# Altium project pay-optical.PrjPCB (part 2 of 2)
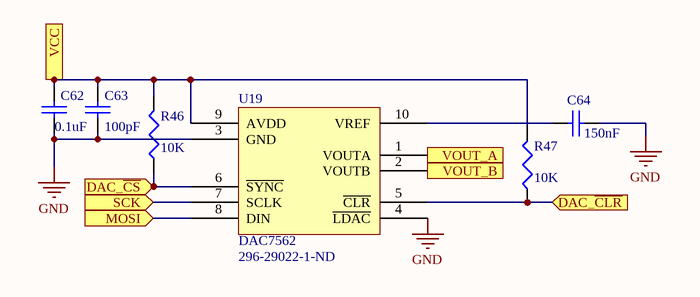
[diagram p8: dac-layout.SchDoc]

## Nets that join several sheets
3V: pay-optical (C13.2 U10.1), adc-optical (12 pins), U_adc-optical/SD1 (14 pins), U_adc-optical/SD1/AC1 (6 pins), U_adc-optical/SD1/AC2 (6 pins), U_adc-optical/SD1/AC3 (6 pins), U_adc-optical/SD1/AC4 (6 pins), U_adc-optical/SD1/AC5 (6 pins), U_adc-optical/SD1/AC6 (6 pins), U_adc-optical/SD1/AC7 (6 pins), U_adc-optical/SD1/AC8 (6 pins), U_adc-optical/SD1/MUX_LED (C44_MUX_LED1.2 C45_MUX_LED1.2 R27_MUX_LED1.2 U12_MUX_LED1.16), U_adc-optical/SD1/MUX_S (C44_MUX_S1.2 C45_MUX_S1.2 R27_MUX_S1.2 U12_MUX_S1.16), U_adc-optical/SD2 (14 pins), U_adc-optical/SD2/AC1 (6 pins), U_adc-optical/SD2/AC2 (6 pins), U_adc-optical/SD2/AC3 (6 pins), U_adc-optical/SD2/AC4 (6 pins), U_adc-optical/SD2/AC5 (6 pins), U_adc-optical/SD2/AC6 (6 pins), U_adc-optical/SD2/AC7 (6 pins), U_adc-optical/SD2/AC8 (6 pins), U_adc-optical/SD2/MUX_LED (C44_MUX_LED2.2 C45_MUX_LED2.2 R27_MUX_LED2.2 U12_MUX_LED2.16), U_adc-optical/SD2/MUX_S (C44_MUX_S2.2 C45_MUX_S2.2 R27_MUX_S2.2 U12_MUX_S2.16), U_adc-optical/SD3 (14 pins), U_adc-optical/SD3/AC1 (6 pins), U_adc-optical/SD3/AC2 (6 pins), U_adc-optical/SD3/AC3 (6 pins), U_adc-optical/SD3/AC4 (6 pins), U_adc-optical/SD3/AC5 (6 pins), U_adc-optical/SD3/AC6 (6 pins), U_adc-optical/SD3/AC7 (6 pins), U_adc-optical/SD3/AC8 (6 pins), U_adc-optical/SD3/MUX_LED (C44_MUX_LED3.2 C45_MUX_LED3.2 R27_MUX_LED3.2 U12_MUX_LED3.16), U_adc-optical/SD3/MUX_S (C44_MUX_S3.2 C45_MUX_S3.2 R27_MUX_S3.2 U12_MUX_S3.16), U_adc-optical/SD4 (14 pins), U_adc-optical/SD4/AC1 (6 pins), U_adc-optical/SD4/AC2 (6 pins), U_adc-optical/SD4/AC3 (6 pins), U_adc-optical/SD4/AC4 (6 pins), U_adc-optical/SD4/AC5 (6 pins), U_adc-optical/SD4/AC6 (6 pins), U_adc-optical/SD4/AC7 (6 pins), U_adc-optical/SD4/AC8 (6 pins), U_adc-optical/SD4/MUX_LED (C44_MUX_LED4.2 C45_MUX_LED4.2 R27_MUX_LED4.2 U12_MUX_LED4.16), U_adc-optical/SD4/MUX_S (C44_MUX_S4.2 C45_MUX_S4.2 R27_MUX_S4.2 U12_MUX_S4.16), U_adc-optical/SD5_Special/AC1 (6 pins), U_adc-optical/SD5_Special/AC2 (6 pins), U_adc-optical/SD5_Special/MUX_LED (C44_MUX_LED5.2 C45_MUX_LED5.2 R27_MUX_LED5.2 U12_MUX_LED5.16), U_adc-optical/SD5_Special/MUX_S (C44_MUX_S5.2 C45_MUX_S5.2 R27_MUX_S5.2 U12_MUX_S5.16), amplifier-special (6 pins), dac-layout (5 pins)
3V3: pay-optical (5 pins), adc-optical (C11.2 R3.2 R4.2 U1.24)
GND: pay-optical (8 pins), adc-optical (26 pins), U_adc-optical/SD1 (17 pins), U_adc-optical/SD1/AC1 (8 pins), U_adc-optical/SD1/AC2 (8 pins), U_adc-optical/SD1/AC3 (8 pins), U_adc-optical/SD1/AC4 (8 pins), U_adc-optical/SD1/AC5 (8 pins), U_adc-optical/SD1/AC6 (8 pins), U_adc-optical/SD1/AC7 (8 pins), U_adc-optical/SD1/AC8 (8 pins), U_adc-optical/SD1/MUX_LED (C44_MUX_LED1.1 C45_MUX_LED1.1 U12_MUX_LED1.7 U12_MUX_LED1.8), U_adc-optical/SD1/MUX_S (C44_MUX_S1.1 C45_MUX_S1.1 U12_MUX_S1.7 U12_MUX_S1.8), U_adc-optical/SD2 (17 pins), U_adc-optical/SD2/AC1 (8 pins), U_adc-optical/SD2/AC2 (8 pins), U_adc-optical/SD2/AC3 (8 pins), U_adc-optical/SD2/AC4 (8 pins), U_adc-optical/SD2/AC5 (8 pins), U_adc-optical/SD2/AC6 (8 pins), U_adc-optical/SD2/AC7 (8 pins), U_adc-optical/SD2/AC8 (8 pins), U_adc-optical/SD2/MUX_LED (C44_MUX_LED2.1 C45_MUX_LED2.1 U12_MUX_LED2.7 U12_MUX_LED2.8), U_adc-optical/SD2/MUX_S (C44_MUX_S2.1 C45_MUX_S2.1 U12_MUX_S2.7 U12_MUX_S2.8), U_adc-optical/SD3 (17 pins), U_adc-optical/SD3/AC1 (8 pins), U_adc-optical/SD3/AC2 (8 pins), U_adc-optical/SD3/AC3 (8 pins), U_adc-optical/SD3/AC4 (8 pins), U_adc-optical/SD3/AC5 (8 pins), U_adc-optical/SD3/AC6 (8 pins), U_adc-optical/SD3/AC7 (8 pins), U_adc-optical/SD3/AC8 (8 pins), U_adc-optical/SD3/MUX_LED (C44_MUX_LED3.1 C45_MUX_LED3.1 U12_MUX_LED3.7 U12_MUX_LED3.8), U_adc-optical/SD3/MUX_S (C44_MUX_S3.1 C45_MUX_S3.1 U12_MUX_S3.7 U12_MUX_S3.8), U_adc-optical/SD4 (17 pins), U_adc-optical/SD4/AC1 (8 pins), U_adc-optical/SD4/AC2 (8 pins), U_adc-optical/SD4/AC3 (8 pins), U_adc-optical/SD4/AC4 (8 pins), U_adc-optical/SD4/AC5 (8 pins), U_adc-optical/SD4/AC6 (8 pins), U_adc-optical/SD4/AC7 (8 pins), U_adc-optical/SD4/AC8 (8 pins), U_adc-optical/SD4/MUX_LED (C44_MUX_LED4.1 C45_MUX_LED4.1 U12_MUX_LED4.7 U12_MUX_LED4.8), U_adc-optical/SD4/MUX_S (C44_MUX_S4.1 C45_MUX_S4.1 U12_MUX_S4.7 U12_MUX_S4.8), U_adc-optical/SD5_Special/AC1 (8 pins), U_adc-optical/SD5_Special/AC2 (8 pins), U_adc-optical/SD5_Special/MUX_LED (C44_MUX_LED5.1 C45_MUX_LED5.1 U12_MUX_LED5.7 U12_MUX_LED5.8), U_adc-optical/SD5_Special/MUX_S (C44_MUX_S5.1 C45_MUX_S5.1 U12_MUX_S5.7 U12_MUX_S5.8), amplifier-special (17 pins), dac-layout (5 pins)
A0: adc-optical (R1.1 U1.4), U_adc-optical/SD1/MUX_LED (U12_MUX_LED1.11), U_adc-optical/SD1/MUX_S (U12_MUX_S1.11), U_adc-optical/SD2/MUX_LED (U12_MUX_LED2.11), U_adc-optical/SD2/MUX_S (U12_MUX_S2.11), U_adc-optical/SD3/MUX_LED (U12_MUX_LED3.11), U_adc-optical/SD3/MUX_S (U12_MUX_S3.11), U_adc-optical/SD4/MUX_LED (U12_MUX_LED4.11), U_adc-optical/SD4/MUX_S (U12_MUX_S4.11), U_adc-optical/SD5_Special/MUX_LED (U12_MUX_LED5.11), U_adc-optical/SD5_Special/MUX_S (U12_MUX_S5.11)
A1: adc-optical (R1.2 U1.3), U_adc-optical/SD1/MUX_LED (U12_MUX_LED1.10), U_adc-optical/SD1/MUX_S (U12_MUX_S1.10), U_adc-optical/SD2/MUX_LED (U12_MUX_LED2.10), U_adc-optical/SD2/MUX_S (U12_MUX_S2.10), U_adc-optical/SD3/MUX_LED (U12_MUX_LED3.10), U_adc-optical/SD3/MUX_S (U12_MUX_S3.10), U_adc-optical/SD4/MUX_LED (U12_MUX_LED4.10), U_adc-optical/SD4/MUX_S (U12_MUX_S4.10), U_adc-optical/SD5_Special/MUX_LED (U12_MUX_LED5.10), U_adc-optical/SD5_Special/MUX_S (U12_MUX_S5.10)
A2: adc-optical (R1.3 U1.2), U_adc-optical/SD1/MUX_LED (U12_MUX_LED1.9), U_adc-optical/SD1/MUX_S (U12_MUX_S1.9), U_adc-optical/SD2/MUX_LED (U12_MUX_LED2.9), U_adc-optical/SD2/MUX_S (U12_MUX_S2.9), U_adc-optical/SD3/MUX_LED (U12_MUX_LED3.9), U_adc-optical/SD3/MUX_S (U12_MUX_S3.9), U_adc-optical/SD4/MUX_LED (U12_MUX_LED4.9), U_adc-optical/SD4/MUX_S (U12_MUX_S4.9), U_adc-optical/SD5_Special/MUX_LED (U12_MUX_LED5.9), U_adc-optical/SD5_Special/MUX_S (U12_MUX_S5.9)
ADC_~{CS}: pay-optical (P1.14), adc-optical (R3.1 U1.32)
ADC_~{SYNC}: pay-optical (P1.16), adc-optical (R4.1 U1.25)
CLKIN: pay-optical (P1.18), U_adc-optical/SD1 (R14_SD1.2), U_adc-optical/SD2 (R14_SD2.2), U_adc-optical/SD3 (R14_SD3.2), U_adc-optical/SD4 (R14_SD4.2)
DAC_~{CS}: pay-optical (P1.12), dac-layout (R46.1 U19.6)
~{EN}: adc-optical (R1.4 U1.1 U15.4), U_adc-optical/SD1/MUX_LED (R27_MUX_LED1.1 U12_MUX_LED1.6), U_adc-optical/SD1/MUX_S (R27_MUX_S1.1 U12_MUX_S1.6), U_adc-optical/SD2/MUX_LED (R27_MUX_LED2.1 U12_MUX_LED2.6), U_adc-optical/SD2/MUX_S (R27_MUX_S2.1 U12_MUX_S2.6), U_adc-optical/SD3/MUX_LED (R27_MUX_LED3.1 U12_MUX_LED3.6), U_adc-optical/SD3/MUX_S (R27_MUX_S3.1 U12_MUX_S3.6)
MISO: pay-optical (P1.4), adc-optical (U1.27)
MOSI: pay-optical (P1.6), adc-optical (U1.28), U_adc-optical/SD1 (U6_SD1.14), U_adc-optical/SD2 (U6_SD2.14), U_adc-optical/SD3 (U6_SD3.14), U_adc-optical/SD4 (U6_SD4.14), dac-layout (U19.8)
MUX_5_EN: pay-optical (P1.10), adc-optical (R7.1 U15.3), U_adc-optical/SD5_Special/MUX_LED (R27_MUX_LED5.1 U12_MUX_LED5.6), U_adc-optical/SD5_Special/MUX_S (R27_MUX_S5.1 U12_MUX_S5.6)
MUX_~{EN}: adc-optical (R6.1 U15.1), U_adc-optical/SD4/MUX_LED (R27_MUX_LED4.1 U12_MUX_LED4.6), U_adc-optical/SD4/MUX_S (R27_MUX_S4.1 U12_MUX_S4.6)
NetC18_1: U_adc-optical/SD5_Special/MUX_S (U12_MUX_S5.12), amplifier-special (C18.1 R35.2 U5.1)
NetC27_SD1_2: U_adc-optical/SD1 (C27_SD1.2), U_adc-optical/SD1/MUX_S (U12_MUX_S1.3)
NetC27_SD2_2: U_adc-optical/SD2 (C27_SD2.2), U_adc-optical/SD2/MUX_S (U12_MUX_S2.3)
NetC27_SD3_2: U_adc-optical/SD3 (C27_SD3.2), U_adc-optical/SD3/MUX_S (U12_MUX_S3.3)
NetC27_SD4_2: U_adc-optical/SD4 (C27_SD4.2), U_adc-optical/SD4/MUX_S (U12_MUX_S4.3), U_adc-optical/SD5_Special/MUX_S (U12_MUX_S5.3)
NetR2_1: adc-optical (R2.1), U_adc-optical/SD1 (U6_SD1.11)
NetR2_2: adc-optical (R2.2), U_adc-optical/SD1 (U6_SD1.10)
NetR2_3: adc-optical (R2.3), U_adc-optical/SD2 (U6_SD2.11)
NetR2_4: adc-optical (R2.4), U_adc-optical/SD2 (U6_SD2.10)
NetR5_1: adc-optical (R5.1), U_adc-optical/SD3 (U6_SD3.11)
NetR5_2: adc-optical (R5.2), U_adc-optical/SD3 (U6_SD3.10)
NetR5_3: adc-optical (R5.3), U_adc-optical/SD4 (U6_SD4.11)
NetR5_4: adc-optical (R5.4), U_adc-optical/SD4 (U6_SD4.10)
NetR8_AC11_1: U_adc-optical/SD1/AC1 (R8_AC11.1), U_adc-optical/SD1/MUX_LED (U12_MUX_LED1.13)
NetR8_AC12_1: U_adc-optical/SD2/AC1 (R8_AC12.1), U_adc-optical/SD2/MUX_LED (U12_MUX_LED2.13)
NetR8_AC13_1: U_adc-optical/SD3/AC1 (R8_AC13.1), U_adc-optical/SD3/MUX_LED (U12_MUX_LED3.13)
NetR8_AC14_1: U_adc-optical/SD4/AC1 (R8_AC14.1), U_adc-optical/SD4/MUX_LED (U12_MUX_LED4.13)
NetR8_AC15_1: U_adc-optical/SD5_Special/AC1 (R8_AC15.1), U_adc-optical/SD5_Special/MUX_LED (U12_MUX_LED5.13)
NetR8_AC21_1: U_adc-optical/SD1/AC2 (R8_AC21.1), U_adc-optical/SD1/MUX_LED (U12_MUX_LED1.14)
NetR8_AC22_1: U_adc-optical/SD2/AC2 (R8_AC22.1), U_adc-optical/SD2/MUX_LED (U12_MUX_LED2.14)
NetR8_AC23_1: U_adc-optical/SD3/AC2 (R8_AC23.1), U_adc-optical/SD3/MUX_LED (U12_MUX_LED3.14)
NetR8_AC24_1: U_adc-optical/SD4/AC2 (R8_AC24.1), U_adc-optical/SD4/MUX_LED (U12_MUX_LED4.14)
NetR8_AC25_1: U_adc-optical/SD5_Special/AC2 (R8_AC25.1), U_adc-optical/SD5_Special/MUX_LED (U12_MUX_LED5.14)
NetR8_AC31_1: U_adc-optical/SD1/AC3 (R8_AC31.1), U_adc-optical/SD1/MUX_LED (U12_MUX_LED1.15)
NetR8_AC32_1: U_adc-optical/SD2/AC3 (R8_AC32.1), U_adc-optical/SD2/MUX_LED (U12_MUX_LED2.15)
NetR8_AC33_1: U_adc-optical/SD3/AC3 (R8_AC33.1), U_adc-optical/SD3/MUX_LED (U12_MUX_LED3.15)
NetR8_AC34_1: U_adc-optical/SD4/AC3 (R8_AC34.1), U_adc-optical/SD4/MUX_LED (U12_MUX_LED4.15)
NetR8_AC41_1: U_adc-optical/SD1/AC4 (R8_AC41.1), U_adc-optical/SD1/MUX_LED (U12_MUX_LED1.12)
NetR8_AC42_1: U_adc-optical/SD2/AC4 (R8_AC42.1), U_adc-optical/SD2/MUX_LED (U12_MUX_LED2.12)
NetR8_AC43_1: U_adc-optical/SD3/AC4 (R8_AC43.1), U_adc-optical/SD3/MUX_LED (U12_MUX_LED3.12)
NetR8_AC44_1: U_adc-optical/SD4/AC4 (R8_AC44.1), U_adc-optical/SD4/MUX_LED (U12_MUX_LED4.12)
NetR8_AC51_1: U_adc-optical/SD1/AC5 (R8_AC51.1), U_adc-optical/SD1/MUX_LED (U12_MUX_LED1.1)
NetR8_AC52_1: U_adc-optical/SD2/AC5 (R8_AC52.1), U_adc-optical/SD2/MUX_LED (U12_MUX_LED2.1)
NetR8_AC53_1: U_adc-optical/SD3/AC5 (R8_AC53.1), U_adc-optical/SD3/MUX_LED (U12_MUX_LED3.1)
NetR8_AC54_1: U_adc-optical/SD4/AC5 (R8_AC54.1), U_adc-optical/SD4/MUX_LED (U12_MUX_LED4.1)
NetR8_AC61_1: U_adc-optical/SD1/AC6 (R8_AC61.1), U_adc-optical/SD1/MUX_LED (U12_MUX_LED1.5)
NetR8_AC62_1: U_adc-optical/SD2/AC6 (R8_AC62.1), U_adc-optical/SD2/MUX_LED (U12_MUX_LED2.5)
NetR8_AC63_1: U_adc-optical/SD3/AC6 (R8_AC63.1), U_adc-optical/SD3/MUX_LED (U12_MUX_LED3.5)
NetR8_AC64_1: U_adc-optical/SD4/AC6 (R8_AC64.1), U_adc-optical/SD4/MUX_LED (U12_MUX_LED4.5)
NetR8_AC71_1: U_adc-optical/SD1/AC7 (R8_AC71.1), U_adc-optical/SD1/MUX_LED (U12_MUX_LED1.2)
NetR8_AC72_1: U_adc-optical/SD2/AC7 (R8_AC72.1), U_adc-optical/SD2/MUX_LED (U12_MUX_LED2.2)
NetR8_AC73_1: U_adc-optical/SD3/AC7 (R8_AC73.1), U_adc-optical/SD3/MUX_LED (U12_MUX_LED3.2)
NetR8_AC74_1: U_adc-optical/SD4/AC7 (R8_AC74.1), U_adc-optical/SD4/MUX_LED (U12_MUX_LED4.2)
NetR8_AC81_1: U_adc-optical/SD1/AC8 (R8_AC81.1), U_adc-optical/SD1/MUX_LED (U12_MUX_LED1.4)
NetR8_AC82_1: U_adc-optical/SD2/AC8 (R8_AC82.1), U_adc-optical/SD2/MUX_LED (U12_MUX_LED2.4)
NetR8_AC83_1: U_adc-optical/SD3/AC8 (R8_AC83.1), U_adc-optical/SD3/MUX_LED (U12_MUX_LED3.4)
NetR8_AC84_1: U_adc-optical/SD4/AC8 (R8_AC84.1), U_adc-optical/SD4/MUX_LED (U12_MUX_LED4.4)
NetR9_U_adc-optical_SD1_AC1_2: U_adc-optical/SD1/AC1 (R9_U_adc-optical_SD1_AC1.2 U3_U_adc-optical_SD1_AC1.1), U_adc-optical/SD1/MUX_S (U12_MUX_S1.13)
NetR9_U_adc-optical_SD1_AC2_2: U_adc-optical/SD1/AC2 (R9_U_adc-optical_SD1_AC2.2 U3_U_adc-optical_SD1_AC2.1), U_adc-optical/SD1/MUX_S (U12_MUX_S1.14)
NetR9_U_adc-optical_SD1_AC3_2: U_adc-optical/SD1/AC3 (R9_U_adc-optical_SD1_AC3.2 U3_U_adc-optical_SD1_AC3.1), U_adc-optical/SD1/MUX_S (U12_MUX_S1.15)
NetR9_U_adc-optical_SD1_AC4_2: U_adc-optical/SD1/AC4 (R9_U_adc-optical_SD1_AC4.2 U3_U_adc-optical_SD1_AC4.1), U_adc-optical/SD1/MUX_S (U12_MUX_S1.12)
NetR9_U_adc-optical_SD1_AC5_2: U_adc-optical/SD1/AC5 (R9_U_adc-optical_SD1_AC5.2 U3_U_adc-optical_SD1_AC5.1), U_adc-optical/SD1/MUX_S (U12_MUX_S1.1)
NetR9_U_adc-optical_SD1_AC6_2: U_adc-optical/SD1/AC6 (R9_U_adc-optical_SD1_AC6.2 U3_U_adc-optical_SD1_AC6.1), U_adc-optical/SD1/MUX_S (U12_MUX_S1.5)
NetR9_U_adc-optical_SD1_AC7_2: U_adc-optical/SD1/AC7 (R9_U_adc-optical_SD1_AC7.2 U3_U_adc-optical_SD1_AC7.1), U_adc-optical/SD1/MUX_S (U12_MUX_S1.2)
NetR9_U_adc-optical_SD1_AC8_2: U_adc-optical/SD1/AC8 (R9_U_adc-optical_SD1_AC8.2 U3_U_adc-optical_SD1_AC8.1), U_adc-optical/SD1/MUX_S (U12_MUX_S1.4)
NetR9_U_adc-optical_SD2_AC1_2: U_adc-optical/SD2/AC1 (R9_U_adc-optical_SD2_AC1.2 U3_U_adc-optical_SD2_AC1.1), U_adc-optical/SD2/MUX_S (U12_MUX_S2.13)
NetR9_U_adc-optical_SD2_AC2_2: U_adc-optical/SD2/AC2 (R9_U_adc-optical_SD2_AC2.2 U3_U_adc-optical_SD2_AC2.1), U_adc-optical/SD2/MUX_S (U12_MUX_S2.14)
NetR9_U_adc-optical_SD2_AC3_2: U_adc-optical/SD2/AC3 (R9_U_adc-optical_SD2_AC3.2 U3_U_adc-optical_SD2_AC3.1), U_adc-optical/SD2/MUX_S (U12_MUX_S2.15)
NetR9_U_adc-optical_SD2_AC4_2: U_adc-optical/SD2/AC4 (R9_U_adc-optical_SD2_AC4.2 U3_U_adc-optical_SD2_AC4.1), U_adc-optical/SD2/MUX_S (U12_MUX_S2.12)
NetR9_U_adc-optical_SD2_AC5_2: U_adc-optical/SD2/AC5 (R9_U_adc-optical_SD2_AC5.2 U3_U_adc-optical_SD2_AC5.1), U_adc-optical/SD2/MUX_S (U12_MUX_S2.1)
NetR9_U_adc-optical_SD2_AC6_2: U_adc-optical/SD2/AC6 (R9_U_adc-optical_SD2_AC6.2 U3_U_adc-optical_SD2_AC6.1), U_adc-optical/SD2/MUX_S (U12_MUX_S2.5)
NetR9_U_adc-optical_SD2_AC7_2: U_adc-optical/SD2/AC7 (R9_U_adc-optical_SD2_AC7.2 U3_U_adc-optical_SD2_AC7.1), U_adc-optical/SD2/MUX_S (U12_MUX_S2.2)
NetR9_U_adc-optical_SD2_AC8_2: U_adc-optical/SD2/AC8 (R9_U_adc-optical_SD2_AC8.2 U3_U_adc-optical_SD2_AC8.1), U_adc-optical/SD2/MUX_S (U12_MUX_S2.4)
NetR9_U_adc-optical_SD3_AC1_2: U_adc-optical/SD3/AC1 (R9_U_adc-optical_SD3_AC1.2 U3_U_adc-optical_SD3_AC1.1), U_adc-optical/SD3/MUX_S (U12_MUX_S3.13)
NetR9_U_adc-optical_SD3_AC2_2: U_adc-optical/SD3/AC2 (R9_U_adc-optical_SD3_AC2.2 U3_U_adc-optical_SD3_AC2.1), U_adc-optical/SD3/MUX_S (U12_MUX_S3.14)
NetR9_U_adc-optical_SD3_AC3_2: U_adc-optical/SD3/AC3 (R9_U_adc-optical_SD3_AC3.2 U3_U_adc-optical_SD3_AC3.1), U_adc-optical/SD3/MUX_S (U12_MUX_S3.15)
NetR9_U_adc-optical_SD3_AC4_2: U_adc-optical/SD3/AC4 (R9_U_adc-optical_SD3_AC4.2 U3_U_adc-optical_SD3_AC4.1), U_adc-optical/SD3/MUX_S (U12_MUX_S3.12)
NetR9_U_adc-optical_SD3_AC5_2: U_adc-optical/SD3/AC5 (R9_U_adc-optical_SD3_AC5.2 U3_U_adc-optical_SD3_AC5.1), U_adc-optical/SD3/MUX_S (U12_MUX_S3.1)
NetR9_U_adc-optical_SD3_AC6_2: U_adc-optical/SD3/AC6 (R9_U_adc-optical_SD3_AC6.2 U3_U_adc-optical_SD3_AC6.1), U_adc-optical/SD3/MUX_S (U12_MUX_S3.5)
NetR9_U_adc-optical_SD3_AC7_2: U_adc-optical/SD3/AC7 (R9_U_adc-optical_SD3_AC7.2 U3_U_adc-optical_SD3_AC7.1), U_adc-optical/SD3/MUX_S (U12_MUX_S3.2)
NetR9_U_adc-optical_SD3_AC8_2: U_adc-optical/SD3/AC8 (R9_U_adc-optical_SD3_AC8.2 U3_U_adc-optical_SD3_AC8.1), U_adc-optical/SD3/MUX_S (U12_MUX_S3.4)
NetR9_U_adc-optical_SD4_AC1_2: U_adc-optical/SD4/AC1 (R9_U_adc-optical_SD4_AC1.2 U3_U_adc-optical_SD4_AC1.1), U_adc-optical/SD4/MUX_S (U12_MUX_S4.13)
NetR9_U_adc-optical_SD4_AC2_2: U_adc-optical/SD4/AC2 (R9_U_adc-optical_SD4_AC2.2 U3_U_adc-optical_SD4_AC2.1), U_adc-optical/SD4/MUX_S (U12_MUX_S4.14)
NetR9_U_adc-optical_SD4_AC3_2: U_adc-optical/SD4/AC3 (R9_U_adc-optical_SD4_AC3.2 U3_U_adc-optical_SD4_AC3.1), U_adc-optical/SD4/MUX_S (U12_MUX_S4.15)
NetR9_U_adc-optical_SD4_AC4_2: U_adc-optical/SD4/AC4 (R9_U_adc-optical_SD4_AC4.2 U3_U_adc-optical_SD4_AC4.1), U_adc-optical/SD4/MUX_S (U12_MUX_S4.12)
NetR9_U_adc-optical_SD4_AC5_2: U_adc-optical/SD4/AC5 (R9_U_adc-optical_SD4_AC5.2 U3_U_adc-optical_SD4_AC5.1), U_adc-optical/SD4/MUX_S (U12_MUX_S4.1)
NetR9_U_adc-optical_SD4_AC6_2: U_adc-optical/SD4/AC6 (R9_U_adc-optical_SD4_AC6.2 U3_U_adc-optical_SD4_AC6.1), U_adc-optical/SD4/MUX_S (U12_MUX_S4.5)
NetR9_U_adc-optical_SD4_AC7_2: U_adc-optical/SD4/AC7 (R9_U_adc-optical_SD4_AC7.2 U3_U_adc-optical_SD4_AC7.1), U_adc-optical/SD4/MUX_S (U12_MUX_S4.2)
NetR9_U_adc-optical_SD4_AC8_2: U_adc-optical/SD4/AC8 (R9_U_adc-optical_SD4_AC8.2 U3_U_adc-optical_SD4_AC8.1), U_adc-optical/SD4/MUX_S (U12_MUX_S4.4)
NetR9_U_adc-optical_SD5_Special_AC1_2: U_adc-optical/SD5_Special/AC1 (R9_U_adc-optical_SD5_Special_AC1.2 U3_U_adc-optical_SD5_Special_AC1.1), U_adc-optical/SD5_Special/MUX_S (U12_MUX_S5.13)
NetR9_U_adc-optical_SD5_Special_AC2_2: U_adc-optical/SD5_Special/AC2 (R9_U_adc-optical_SD5_Special_AC2.2 U3_U_adc-optical_SD5_Special_AC2.1), U_adc-optical/SD5_Special/MUX_S (U12_MUX_S5.14)
NetU1_19: adc-optical (U1.19), dac-layout (U19.1)
NetU1_20: adc-optical (U1.20), dac-layout (U19.2)
NetU3_1: U_adc-optical/SD5_Special/MUX_S (U12_MUX_S5.15), amplifier-special (U3.1 U3.4)
NetU9_SD1_1: U_adc-optical/SD1 (U9_SD1.1 U9_SD1.4), U_adc-optical/SD1/MUX_LED (U12_MUX_LED1.3)
NetU9_SD2_1: U_adc-optical/SD2 (U9_SD2.1 U9_SD2.4), U_adc-optical/SD2/MUX_LED (U12_MUX_LED2.3)
NetU9_SD3_1: U_adc-optical/SD3 (U9_SD3.1 U9_SD3.4), U_adc-optical/SD3/MUX_LED (U12_MUX_LED3.3)
NetU9_SD4_1: U_adc-optical/SD4 (U9_SD4.1 U9_SD4.4), U_adc-optical/SD4/MUX_LED (U12_MUX_LED4.3), U_adc-optical/SD5_Special/MUX_LED (U12_MUX_LED5.3)
SCK: pay-optical (P1.8), adc-optical (U1.31), U_adc-optical/SD1 (U6_SD1.15), U_adc-optical/SD2 (U6_SD2.15), U_adc-optical/SD3 (U6_SD3.15), U_adc-optical/SD4 (U6_SD4.15), dac-layout (U19.7)
SD1_~{CS}: pay-optical (P1.9), U_adc-optical/SD1 (R15_SD1.1 U6_SD1.3)
SD2_~{CS}: pay-optical (P1.7), U_adc-optical/SD2 (R15_SD2.1 U6_SD2.3)
SD3_~{CS}: pay-optical (P1.5), U_adc-optical/SD3 (R15_SD3.1 U6_SD3.3)
SD4_~{CS}: pay-optical (P1.3), U_adc-optical/SD4 (R15_SD4.1 U6_SD4.3)
SYNCO1: pay-optical (P1.17), U_adc-optical/SD1 (U6_SD1.2)
SYNCO2: pay-optical (P1.15), U_adc-optical/SD2 (U6_SD2.2)
SYNCO3: pay-optical (P1.13), U_adc-optical/SD3 (U6_SD3.2)
SYNCO4: pay-optical (P1.11), U_adc-optical/SD4 (U6_SD4.2)